# EAGLE design C64_Prototyping_Cart_no_reset (EAGLE 8.6.0)
CNAME: C64 Protytyping cartridge with no reset button; CREVISION: 1.0; DESIGNER: Tomse @ http://retro-commodore.eu
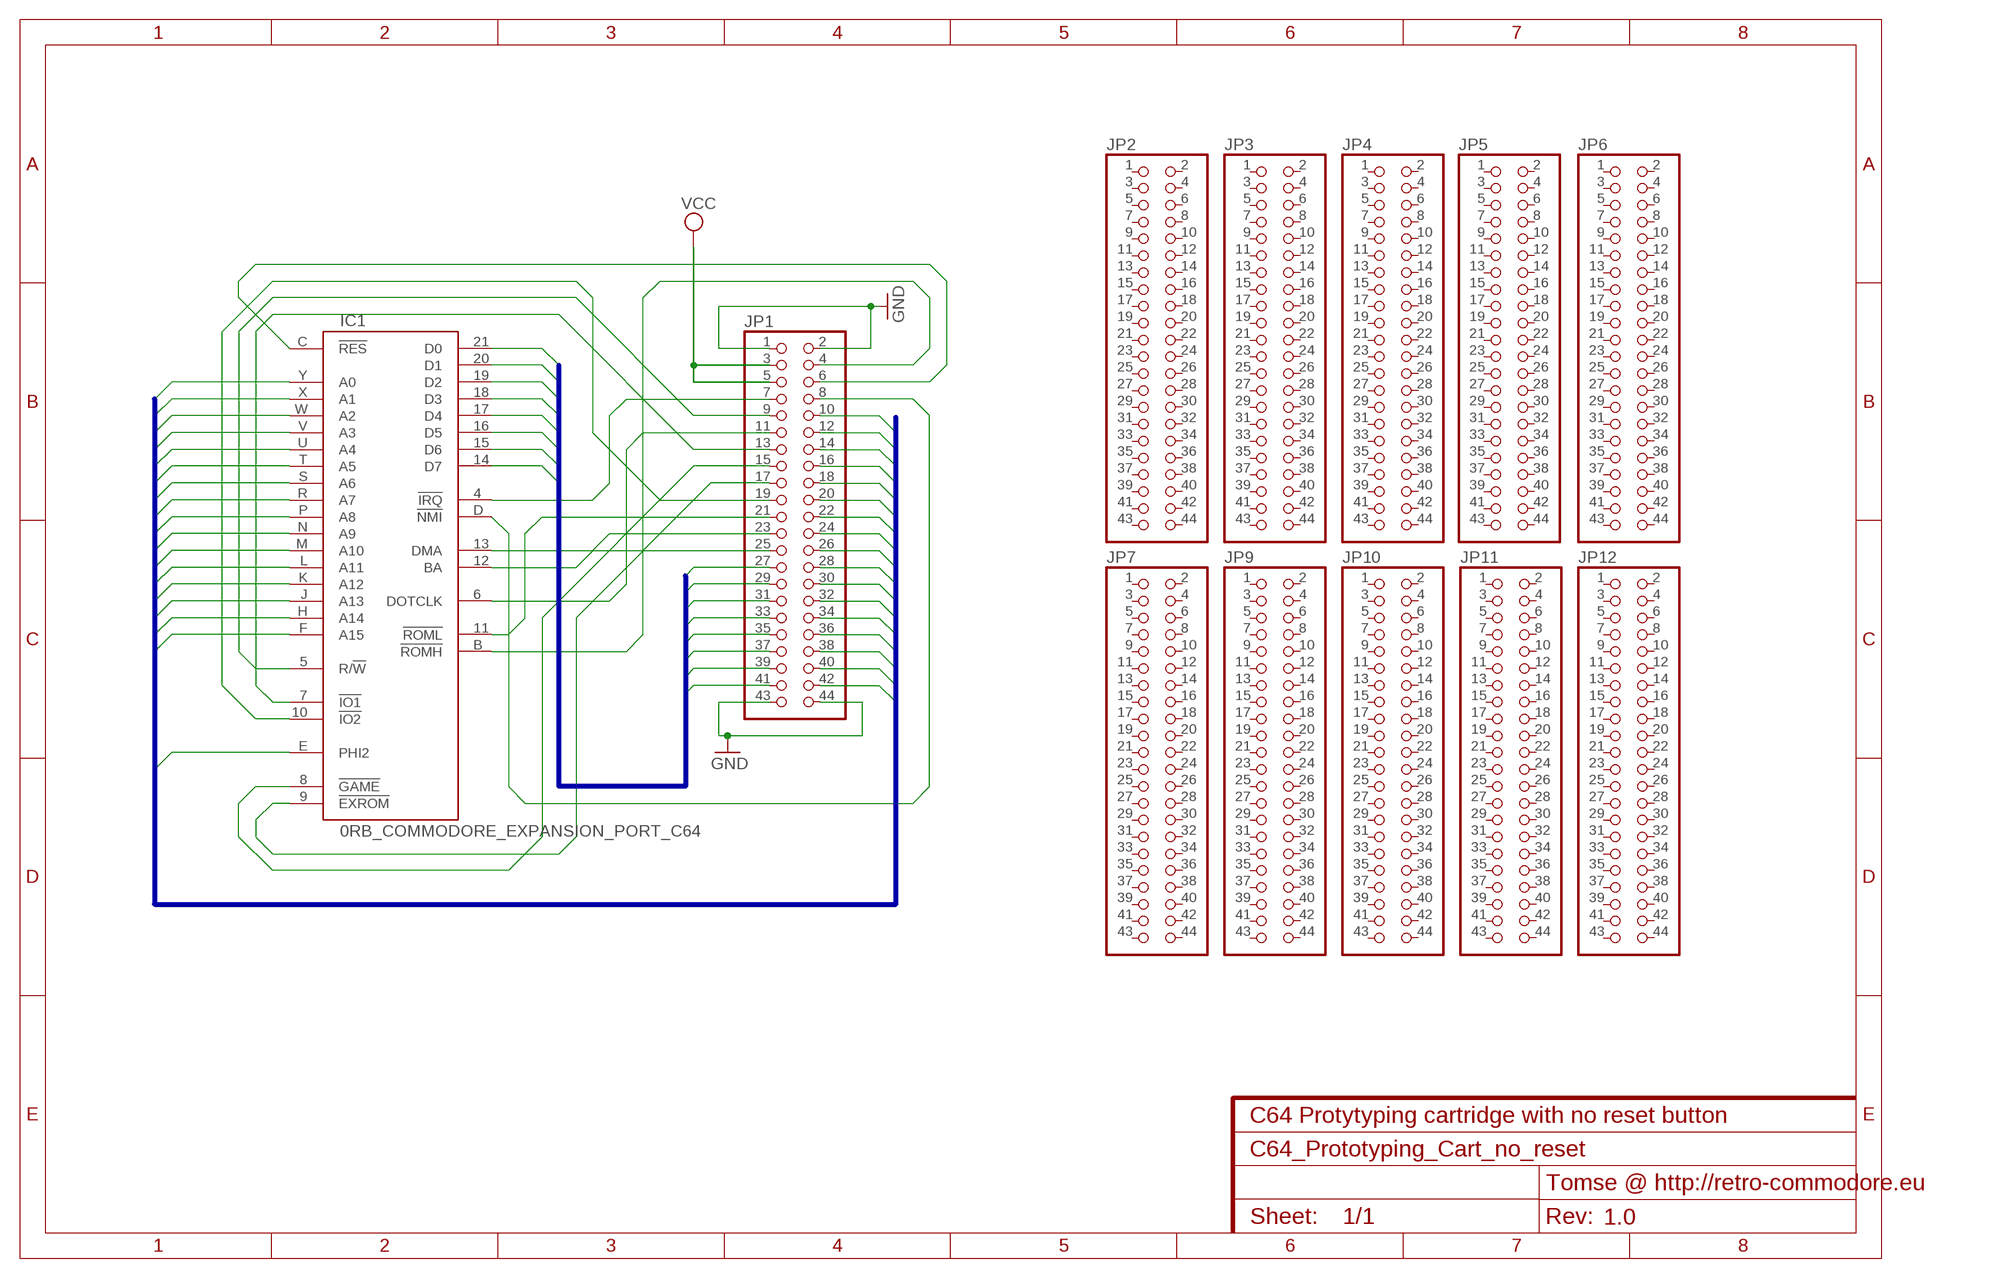
[diagram p0: schematic, sheet 1]

## Parts
IC1  0RB_COMMODORE_EXPANSION_PORT_C64  [0RB_COMMODORE_MA100-22-2]
JP1  PINHD-2X22  [2X22]
JP2  PINHD-2X22  [2X22]
JP3  PINHD-2X22  [2X22]
JP4  PINHD-2X22  [2X22]
JP5  PINHD-2X22  [2X22]
JP6  PINHD-2X22  [2X22]
JP7  PINHD-2X22  [2X22]
JP9  PINHD-2X22  [2X22]
JP10  PINHD-2X22  [2X22]
JP11  PINHD-2X22  [2X22]
JP12  PINHD-2X22  [2X22]

## Nets
!EXROM: IC1.9(!EXROM) JP1.17
!GAME: IC1.8(!GAME) JP1.15
!IO1: IC1.7(!IO1) JP1.13
!IO2: IC1.10(!IO2) JP1.19
!IRQ: IC1.4(!IRQ) JP1.7
!NMI: IC1.D(!NMI) JP1.8
!RES: IC1.C(!RES) JP1.6
!ROML: IC1.11(!ROML) JP1.21
A0: IC1.Y(A0) JP1.42
A1: IC1.X(A1) JP1.40
A2: IC1.W(A2) JP1.38
A3: IC1.V(A3) JP1.36
A4: IC1.U(A4) JP1.34
A5: IC1.T(A5) JP1.32
A6: IC1.S(A6) JP1.30
A7: IC1.R(A7) JP1.28
A8: IC1.P(A8) JP1.26
A9: IC1.N(A9) JP1.24
A10: IC1.M(A10) JP1.22
A11: IC1.L(A11) JP1.20
A12: IC1.K(A12) JP1.18
A13: IC1.J(A13) JP1.16
A14: IC1.H(A14) JP1.14
A15: IC1.F(A15) JP1.12
BA: IC1.12(BA) JP1.23
D0: IC1.21(D0) JP1.41
D1: IC1.20(D1) JP1.39
D2: IC1.19(D2) JP1.37
D3: IC1.18(D3) JP1.35
D4: IC1.17(D4) JP1.33
D5: IC1.16(D5) JP1.31
D6: IC1.15(D6) JP1.29
D7: IC1.14(D7) JP1.27
DMA: IC1.13(DMA) JP1.25
DOTCLK: IC1.6(DOTCLK) JP1.11
GND: JP1.1 JP1.2 JP1.43 JP1.44
N$1: IC1.B(!ROMH) JP1.4
PHI2: IC1.E(PHI2) JP1.10
R!W: IC1.5(R/!W) JP1.9
VCC: JP1.3 JP1.5
Unconnected: JP2.1 JP2.2 JP2.3 JP2.4 JP2.5 JP2.6 JP2.7 JP2.8 JP2.9 JP2.10 JP2.11 JP2.12 JP2.13 JP2.14 JP2.15 JP2.16 JP2.17 JP2.18 JP2.19 JP2.20 JP2.21 JP2.22 JP2.23 JP2.24 JP2.25 JP2.26 JP2.27 JP2.28 JP2.29 JP2.30 JP2.31 JP2.32 JP2.33 JP2.34 JP2.35 JP2.36 JP2.37 JP2.38 JP2.39 JP2.40 JP2.41 JP2.42 JP2.43 JP2.44 JP3.1 JP3.2 JP3.3 JP3.4 JP3.5 JP3.6 JP3.7 JP3.8 JP3.9 JP3.10 JP3.11 JP3.12 JP3.13 JP3.14 JP3.15 JP3.16 JP3.17 JP3.18 JP3.19 JP3.20 JP3.21 JP3.22 JP3.23 JP3.24 JP3.25 JP3.26 JP3.27 JP3.28 JP3.29 JP3.30 JP3.31 JP3.32 JP3.33 JP3.34 JP3.35 JP3.36 JP3.37 JP3.38 JP3.39 JP3.40 JP3.41 JP3.42 JP3.43 JP3.44 JP4.1 JP4.2 JP4.3 JP4.4 JP4.5 JP4.6 JP4.7 JP4.8 JP4.9 JP4.10 JP4.11 JP4.12 JP4.13 JP4.14 JP4.15 JP4.16 JP4.17 JP4.18 JP4.19 JP4.20 JP4.21 JP4.22 JP4.23 JP4.24 JP4.25 JP4.26 JP4.27 JP4.28 JP4.29 JP4.30 JP4.31 JP4.32 JP4.33 JP4.34 JP4.35 JP4.36 JP4.37 JP4.38 JP4.39 JP4.40 JP4.41 JP4.42 JP4.43 JP4.44 JP5.1 JP5.2 JP5.3 JP5.4 JP5.5 JP5.6 JP5.7 JP5.8 JP5.9 JP5.10 JP5.11 JP5.12 JP5.13 JP5.14 JP5.15 JP5.16 JP5.17 JP5.18 JP5.19 JP5.20 JP5.21 JP5.22 JP5.23 JP5.24 JP5.25 JP5.26 JP5.27 JP5.28 JP5.29 JP5.30 JP5.31 JP5.32 JP5.33 JP5.34 JP5.35 JP5.36 JP5.37 JP5.38 JP5.39 JP5.40 JP5.41 JP5.42 JP5.43 JP5.44 JP6.1 JP6.2 JP6.3 JP6.4 JP6.5 JP6.6 JP6.7 JP6.8 JP6.9 JP6.10 JP6.11 JP6.12 JP6.13 JP6.14 JP6.15 JP6.16 JP6.17 JP6.18 JP6.19 JP6.20 JP6.21 JP6.22 JP6.23 JP6.24 JP6.25 JP6.26 JP6.27 JP6.28 JP6.29 JP6.30 JP6.31 JP6.32 JP6.33 JP6.34 JP6.35 JP6.36 JP6.37 JP6.38 JP6.39 JP6.40 JP6.41 JP6.42 JP6.43 JP6.44 JP7.1 JP7.2 JP7.3 JP7.4 JP7.5 JP7.6 JP7.7 JP7.8 JP7.9 JP7.10 JP7.11 JP7.12 JP7.13 JP7.14 JP7.15 JP7.16 JP7.17 JP7.18 JP7.19 JP7.20 JP7.21 JP7.22 JP7.23 JP7.24 JP7.25 JP7.26 JP7.27 JP7.28 JP7.29 JP7.30 JP7.31 JP7.32 JP7.33 JP7.34 JP7.35 JP7.36 JP7.37 JP7.38 JP7.39 JP7.40 JP7.41 JP7.42 JP7.43 JP7.44 JP9.1 JP9.2 JP9.3 JP9.4 JP9.5 JP9.6 JP9.7 JP9.8 JP9.9 JP9.10 JP9.11 JP9.12 JP9.13 JP9.14 JP9.15 JP9.16 JP9.17 JP9.18 JP9.19 JP9.20 JP9.21 JP9.22 JP9.23 JP9.24 JP9.25 JP9.26 JP9.27 JP9.28 JP9.29 JP9.30 JP9.31 JP9.32 JP9.33 JP9.34 JP9.35 JP9.36 JP9.37 JP9.38 JP9.39 JP9.40 JP9.41 JP9.42 JP9.43 JP9.44 JP10.1 JP10.2 JP10.3 JP10.4 JP10.5 JP10.6 JP10.7 JP10.8 JP10.9 JP10.10 JP10.11 JP10.12 JP10.13 JP10.14 JP10.15 JP10.16 JP10.17 JP10.18 JP10.19 JP10.20 JP10.21 JP10.22 JP10.23 JP10.24 JP10.25 JP10.26 JP10.27 JP10.28 JP10.29 JP10.30 JP10.31 JP10.32 JP10.33 JP10.34 JP10.35 JP10.36 JP10.37 JP10.38 JP10.39 JP10.40 JP10.41 JP10.42 JP10.43 JP10.44 JP11.1 JP11.2 JP11.3 JP11.4 JP11.5 JP11.6 JP11.7 JP11.8 JP11.9 JP11.10 JP11.11 JP11.12 JP11.13 JP11.14 JP11.15 JP11.16 JP11.17 JP11.18 JP11.19 JP11.20 JP11.21 JP11.22 JP11.23 JP11.24 JP11.25 JP11.26 JP11.27 JP11.28 JP11.29 JP11.30 JP11.31 JP11.32 JP11.33 JP11.34 JP11.35 JP11.36 JP11.37 JP11.38 JP11.39 JP11.40 JP11.41 JP11.42 JP11.43 JP11.44 JP12.1 JP12.2 JP12.3 JP12.4 JP12.5 JP12.6 JP12.7 JP12.8 JP12.9 JP12.10 JP12.11 JP12.12 JP12.13 JP12.14 JP12.15 JP12.16 JP12.17 JP12.18 JP12.19 JP12.20 JP12.21 JP12.22 JP12.23 JP12.24 JP12.25 JP12.26 JP12.27 JP12.28 JP12.29 JP12.30 JP12.31 JP12.32 JP12.33 JP12.34 JP12.35 JP12.36 JP12.37 JP12.38 JP12.39 JP12.40 JP12.41 JP12.42 JP12.43 JP12.44

## Buses
D0,D1,D2,D3,D4,D5,D6,D7
A0,A1,A2,A3,A4,A5,A6,A7,A8,A9,A10,A11,A12,A13,A14,A15,PHI2

## Power pins joined to a net without a drawn wire
GND: IC1.1(GND) IC1.22(GND) IC1.A(GND) IC1.Z(GND)
VCC: IC1.2(VCC) IC1.3(VCC)

## Library data of the parts
IC1 = C64CartridgeEdgeConnector:0RB_COMMODORE_EXPANSION_PORT_C64
JP1-JP7 JP9-JP12 = pinhead:PINHD-2X22: PIN HEADER

## Net classes
0 default: clearance 0.205 mm

## Board
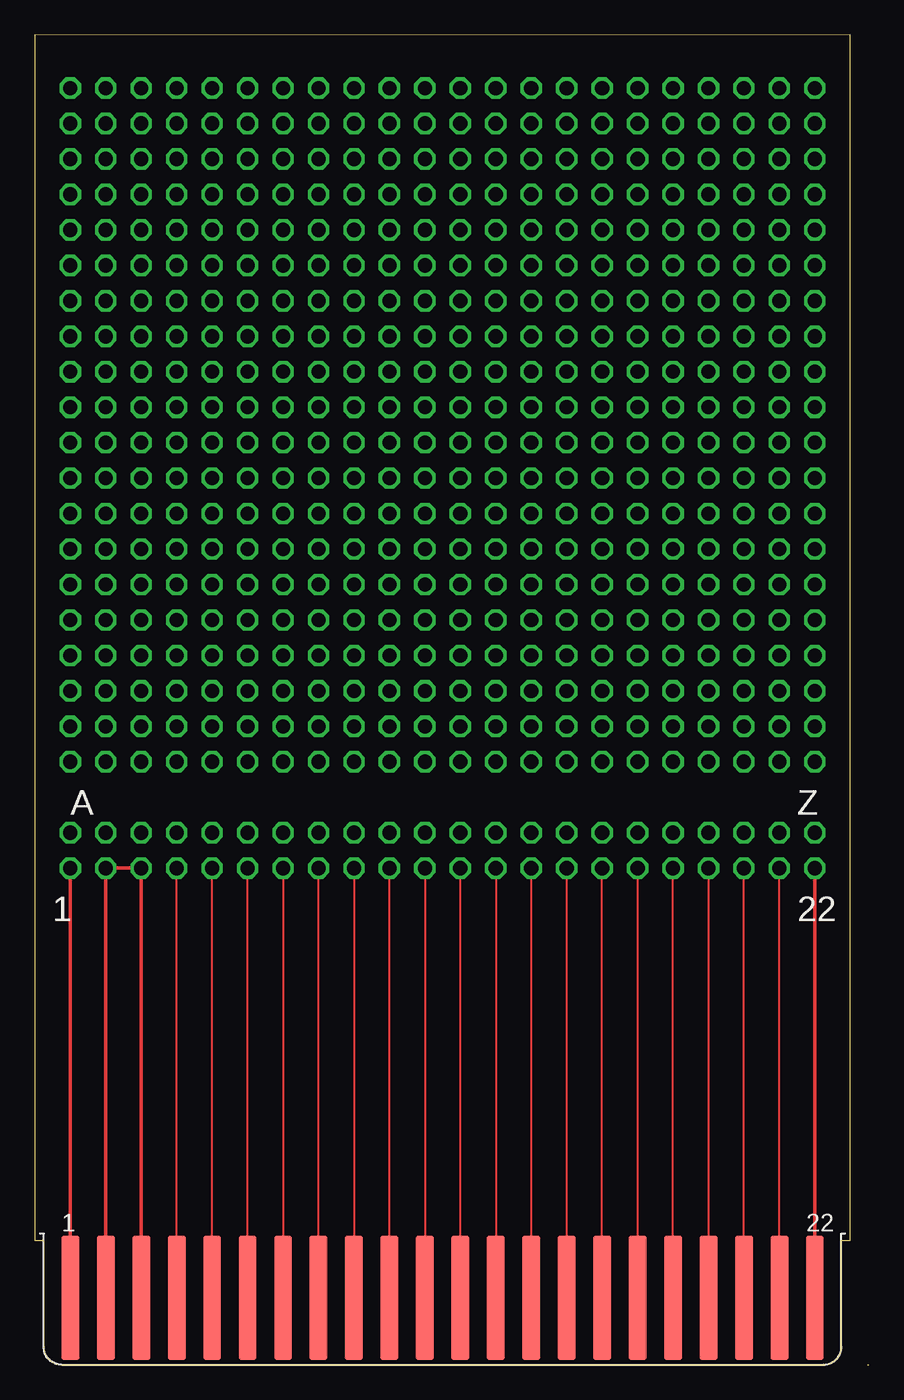
[diagram p1: board, top side]
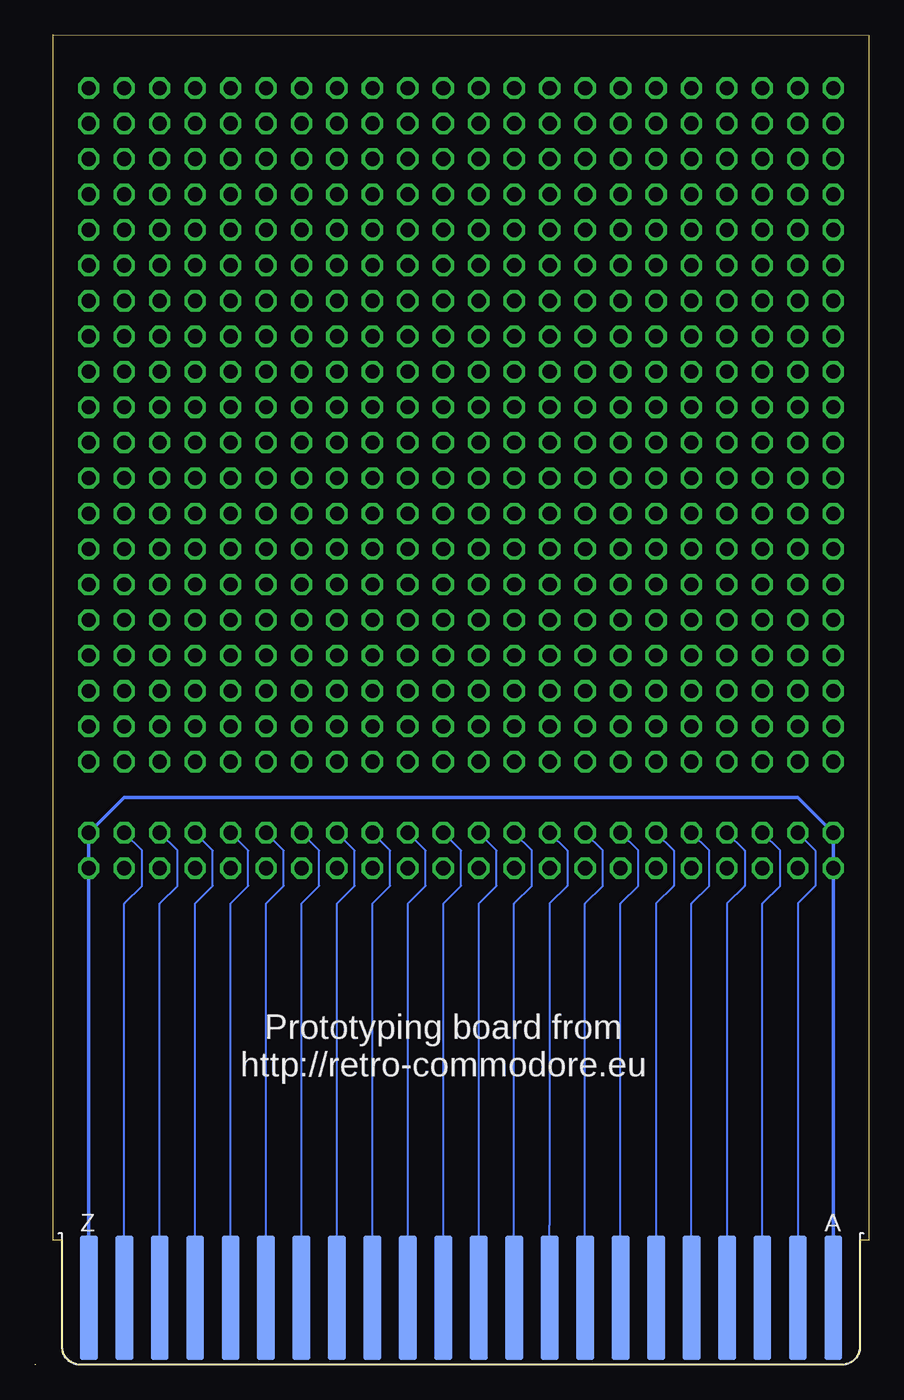
[diagram p2: board, bottom side, seen from below]

Size 59.74 x 95.25 mm. Coordinates in mm from the lower left corner, seen from the top.
Outline: 59.69,0 59.74,0
Outline: 0,95.24 0,8.89 0.64,8.89 0.64,1.27 arc90 1.91,0 56.52,0 arc90 57.78,1.27 57.78,8.89 58.42,8.89 58.42,95.25 0,95.24
Copper layers (1*16): Top 0.035mm / dielectric 1.5mm / Bottom 0.035mm
Design rules "default": minimum track width 6mil, minimum drill 0.35mm, track to track 6mil, track to pad 6mil, pad to pad 6mil, via to via 6mil, smd to smd 6mil, copper to edge 40mil, drill to drill 6mil, minimum pad ring 10mil, minimum via ring 8mil, stop-mask expansion 4mil, vias tented up to drill 0mil, thermal gap 10mil

### Footprints (pad centres in the part's own frame; a part is rotated, then mirrored left to right if it is on the bottom)
0RB_COMMODORE_MA100-22-2 = smd 1.27 x 8.89: 1 -26.67,-0.305; 2 -24.13,-0.305; 3 -21.59,-0.305; 4 -19.05,-0.305; 5 -16.51,-0.305; 6 -13.97,-0.305; 7 -11.43,-0.305; 8 -8.89,-0.305; 9 -6.35,-0.305; 10 -3.81,-0.305; 11 -1.27,-0.305; 12 1.27,-0.305; 13 3.81,-0.305; 14 6.35,-0.305; 15 8.89,-0.305; 16 11.43,-0.305; 17 13.97,-0.305; 18 16.51,-0.305; 19 19.05,-0.305; 20 21.59,-0.305; 21 24.13,-0.305; 22 26.67,-0.305 | smd 1.27 x 8.89 bottom: A -26.67,-0.305; B -24.13,-0.305; C -21.59,-0.305; D -19.05,-0.305; E -16.51,-0.305; F -13.97,-0.305; H -11.43,-0.305; J -8.89,-0.305; K -6.35,-0.305; L -3.81,-0.305; M -1.27,-0.305; N 1.27,-0.305; P 3.81,-0.305; R 6.35,-0.305; S 8.89,-0.305; T 11.43,-0.305; U 13.97,-0.305; V 16.51,-0.305; W 19.05,-0.305; X 21.59,-0.305; Y 24.13,-0.305; Z 26.67,-0.305
2X22 = drill 1.016 octagon: 1 -25.4,-1.27; 2 -25.4,1.27; 3 -22.86,-1.27; 4 -22.86,1.27; 5 -20.32,-1.27; 6 -20.32,1.27; 7 -17.78,-1.27; 8 -17.78,1.27; 9 -15.24,-1.27; 10 -15.24,1.27; 11 -12.7,-1.27; 12 -12.7,1.27; 13 -10.16,-1.27; 14 -10.16,1.27; 15 -7.62,-1.27; 16 -7.62,1.27; 17 -5.08,-1.27; 18 -5.08,1.27; 19 -2.54,-1.27; 20 -2.54,1.27; 21 0,-1.27; 22 0,1.27; 23 2.54,-1.27; 24 2.54,1.27; 25 5.08,-1.27; 26 5.08,1.27; 27 7.62,-1.27; 28 7.62,1.27; 29 10.16,-1.27; 30 10.16,1.27; 31 12.7,-1.27; 32 12.7,1.27; 33 15.24,-1.27; 34 15.24,1.27; 35 17.78,-1.27; 36 17.78,1.27; 37 20.32,-1.27; 38 20.32,1.27; 39 22.86,-1.27; 40 22.86,1.27; 41 25.4,-1.27; 42 25.4,1.27; 43 27.94,-1.27; 44 27.94,1.27

### Placement (x,y rotation side)
IC1  29.21,5.08 0 top
JP1  27.94,36.83 0 top
JP2  27.94,44.45 0 top
JP3  27.94,49.53 0 top
JP4  27.94,54.61 0 top
JP5  27.94,59.69 0 top
JP6  27.94,64.77 0 top
JP7  27.94,90.17 0 top
JP9  27.94,80.01 0 top
JP10  27.94,74.93 0 top
JP11  27.94,69.85 0 top
JP12  27.94,85.09 0 top

### Tracks (layer width: path | path; a pad name or v marks a point on that pad's centre or on a via)
!EXROM
  Top 0.152: JP1.17 IC1.9
!GAME
  Top 0.152: IC1.8 JP1.15
!IO1
  Top 0.152: JP1.13 IC1.7
!IO2
  Top 0.152: IC1.10 JP1.19
!IRQ
  Top 0.152: IC1.4 JP1.7
!NMI
  Bottom 0.152: JP1.8 8.89,36.83 8.89,34.29 10.16,33.02 IC1.D
!RES
  Bottom 0.152: IC1.C 7.62,33.02 6.35,34.29 6.35,36.83 JP1.6
!ROML
  Top 0.152: JP1.21 IC1.11
A0
  Bottom 0.152: JP1.42 52.07,36.83 52.07,34.29 53.34,33.02 IC1.Y
A1
  Bottom 0.152: JP1.40 49.53,36.83 49.53,34.29 50.8,33.02 IC1.X
A2
  Bottom 0.152: JP1.38 46.99,36.83 46.99,34.29 48.26,33.02 IC1.W
A3
  Bottom 0.152: JP1.36 44.45,36.83 44.45,34.29 45.72,33.02 IC1.V
A4
  Bottom 0.152: JP1.34 41.91,36.83 41.91,34.29 43.18,33.02 IC1.U
A5
  Bottom 0.152: JP1.32 39.37,36.83 39.37,34.29 40.64,33.02 IC1.T
A6
  Bottom 0.152: JP1.30 36.83,36.83 36.83,34.29 38.1,33.02 IC1.S
A7
  Bottom 0.152: JP1.28 34.29,36.83 34.29,34.29 35.56,33.02 IC1.R
A8
  Bottom 0.152: JP1.26 31.75,36.83 31.75,34.29 33.02,33.02 IC1.P
A9
  Bottom 0.152: JP1.24 29.21,36.83 29.21,34.29 30.48,33.02 IC1.N
A10
  Bottom 0.152: JP1.22 26.67,36.83 26.67,34.29 27.94,33.02 IC1.M
A11
  Bottom 0.152: JP1.20 24.13,36.83 24.13,34.29 25.4,33.02 IC1.L
A12
  Bottom 0.152: 22.86,7.8 IC1.K 22.86,9.98 22.86,11.43 22.86,33.02 21.59,34.29 21.59,36.83 JP1.18
A13
  Bottom 0.152: JP1.16 19.05,36.83 19.05,34.29 20.32,33.02 IC1.J
A14
  Bottom 0.152: IC1.H 17.78,33.02 16.51,34.29 16.51,36.83 JP1.14
A15
  Bottom 0.152: JP1.12 13.97,36.83 13.97,34.29 15.24,33.02 IC1.F
BA
  Top 0.152: IC1.12 JP1.23
D0
  Top 0.152: IC1.21 JP1.41
D1
  Top 0.152: IC1.20 JP1.39
D2
  Top 0.152: JP1.37 IC1.19
D3
  Top 0.152: IC1.18 JP1.35
D4
  Top 0.152: JP1.33 IC1.17
D5
  Top 0.152: IC1.16 JP1.31
D6
  Top 0.152: JP1.29 IC1.15
D7
  Top 0.152: IC1.14 JP1.27
DMA
  Top 0.152: JP1.25 IC1.13
DOTCLK
  Top 0.152: IC1.6 JP1.11
GND
  Top 0.254: IC1.A JP1.1 | IC1.Z JP1.43
  Bottom 0.254: IC1.A JP1.1 JP1.2 5.08,40.64 53.34,40.64 JP1.44 JP1.43 IC1.Z
N$1
  Bottom 0.152: IC1.B 5.08,33.02 3.81,34.29 3.81,36.83 JP1.4
PHI2
  Bottom 0.152: IC1.E 12.7,33.02 11.43,34.29 11.43,36.83 JP1.10
R!W
  Top 0.152: IC1.5 JP1.9
VCC
  Top 0.254: IC1.3 JP1.5 JP1.3 IC1.2

### Text on the board
tPlace: A | Z | 1 | 22
bNames: Prototyping board from / http://retro-commodore.eu